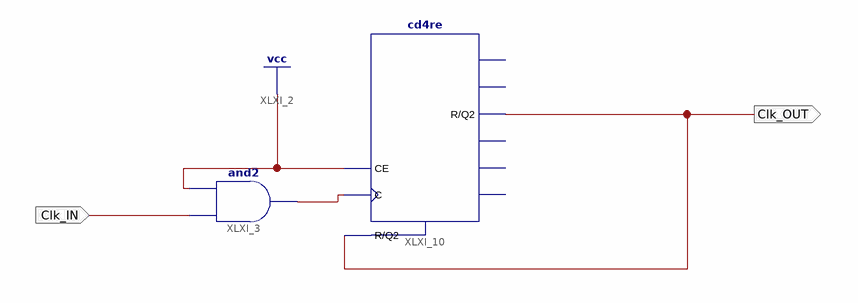
[diagram p0: schematic sheet 1]
// Xilinx ISE schematic div5_2.sch (spartan6) as structural Verilog: 2 symbols, 2 ports
module div5_2 (
  input  Clk_IN,
  output Clk_OUT
);

  wire XLXN_2;

  and XLXI_3 (XLXN_2, Clk_IN, 1'b1);
  cd4re XLXI_10 (.C(XLXN_2), .CE(1'b1), .R(Clk_OUT), .Q2(Clk_OUT));  // open: CEO, Q0, Q1, Q3, TC
endmodule
